# Altium project Transceiver_Project.PrjPCB
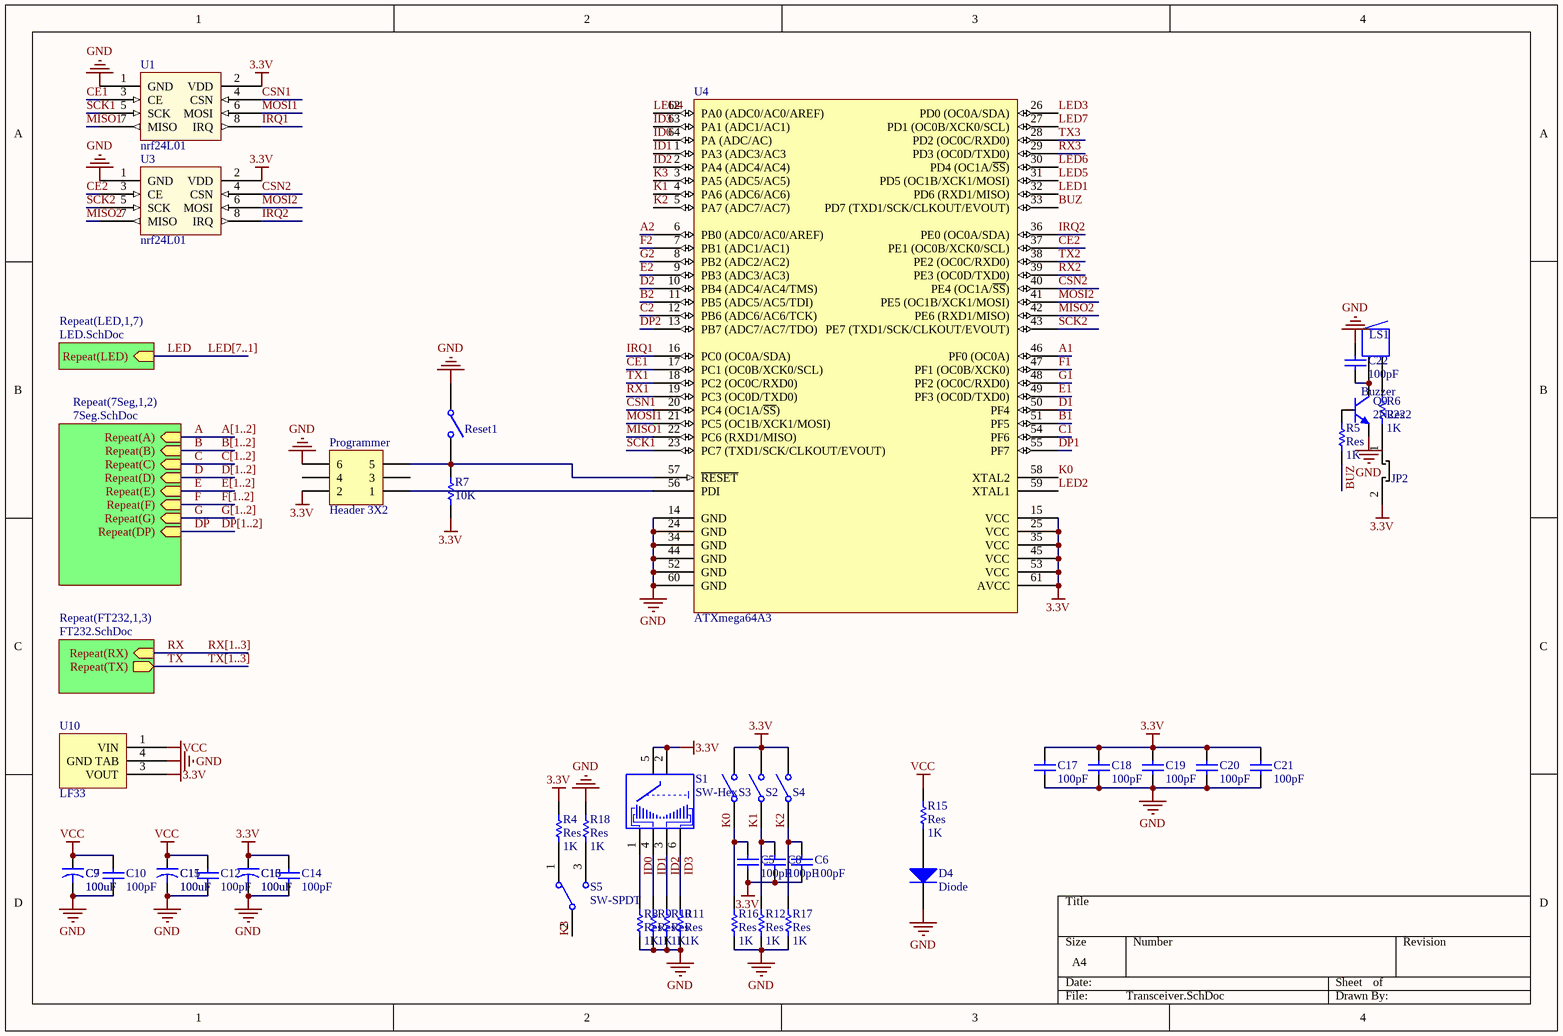
[diagram p0: Transceiver.SchDoc]
4 sheets, 117 parts. Net scope: hierarchical (ports join the sheet entries above them; power ports are global).
Board file: Transceiver.PcbDoc
Sheets:
  Transceiver.SchDoc
    FT2321 = FT232.SchDoc
    FT2322 = FT232.SchDoc
    FT2323 = FT232.SchDoc
    7Seg1 = 7Seg.SchDoc
    7Seg2 = 7Seg.SchDoc
    LED1 = LED.SchDoc
    LED2 = LED.SchDoc
    LED3 = LED.SchDoc
    LED4 = LED.SchDoc
    LED5 = LED.SchDoc
    LED6 = LED.SchDoc
    LED7 = LED.SchDoc

## Sheet Transceiver.SchDoc
size A4

### Parts
C5  value 100pF  [2012[0805]]  (hidden comment: Cap_UP)
C6  value 100pF  [2012[0805]]  (hidden comment: Cap_UP)
C7  value 100uF  [EL_M]  (hidden comment: Cap_El)
C8  value 100pF  [2012[0805]]  (hidden comment: Cap_UP)
C9  value 100uF  [EL_M]  (hidden comment: Cap_El)
C10  value 100pF  [2012[0805]]  (hidden comment: Cap_UP)
C11  value 100uF  [EL_M]  (hidden comment: Cap_El)
C12  value 100pF  [2012[0805]]  (hidden comment: Cap_UP)
C13  value 100uF  [EL_M]  (hidden comment: Cap_El)
C14  value 100pF  [2012[0805]]  (hidden comment: Cap_UP)
C15  value 100uF  [EL_M]  (hidden comment: Cap_El)
C16  value 100uF  [EL_M]  (hidden comment: Cap_El)
C17  value 100pF  [2012[0805]]  (hidden comment: Cap_UP)
C18  value 100pF  [2012[0805]]  (hidden comment: Cap_UP)
C19  value 100pF  [2012[0805]]  (hidden comment: Cap_UP)
C20  value 100pF  [2012[0805]]  (hidden comment: Cap_UP)
C21  value 100pF  [2012[0805]]  (hidden comment: Cap_UP)
C22  value 100pF  [2012[0805]]  (hidden comment: Cap_UP)
D4  Diode  [2012[0805]]
JP2  JUMPER  [HDR1X2]  (value not drawn)
LS1  Buzzer  [BUZZER]
Programmer  Header 3X2  [HDRBOX2X3]
Q9  2N2222  [SOT-23]
R4  Res  value 1K  [2012[0805]]
R5  Res  value 1K  [2012[0805]]
R6  Res  value 1K  [2012[0805]]
R7  10K  [2012[0805]]
R8  Res  value 1K  [2012[0805]]
R9  Res  value 1K  [2012[0805]]
R10  Res  value 1K  [2012[0805]]
R11  Res  value 1K  [2012[0805]]
R12  Res  value 1K  [2012[0805]]
R15  Res  value 1K  [2012[0805]]
R16  Res  value 1K  [2012[0805]]
R17  Res  value 1K  [2012[0805]]
R18  Res  value 1K  [2012[0805]]
Reset1  SW-SPST  [PUSH-BUT]  (value not drawn)
S1  SW-Hex  [SW-HEX]
S2  SW-SPST  [PUSH-BUT-SMD]  (value not drawn)
S3  SW-SPST  [PUSH-BUT]  (value not drawn)
S4  SW-SPST  [PUSH-BUT]  (value not drawn)
S5  SW-SPDT  [SW-SPDT]
U1  nrf24L01  [NRF24L01+PA+LNA]
U3  nrf24L01  [NRF24L01+PA+LNA]
U4  ATXmega64A3  [64A_N]
U10  LF33  [D-PACK]

### Sub-sheets
Repeat(7Seg,1,2) = 7Seg.SchDoc: Repeat(A) (in), Repeat(B) (in), Repeat(C) (in), Repeat(D) (in), Repeat(E) (in), Repeat(F) (in), Repeat(G) (in), Repeat(DP) (in)
Repeat(FT232,1,3) = FT232.SchDoc: Repeat(RX) (in), Repeat(TX) (out)
Repeat(LED,1,7) = LED.SchDoc: Repeat(LED) (in)

### Nets
3.3V: C5.2 C6.2 C8.2 C13.1 C14.2 C16.1 C17.2 C18.2 C19.2 C20.2 C21.2 JP2.2 Programmer.2 R4.2 R7.1 S1.2 S1.5 S2.2(NO) S3.2(NO) S4.2(NO) U1.2(VDD) U3.2(VDD) U4.15(VCC) U4.25(VCC) U4.35(VCC) U4.45(VCC) U4.53(VCC) U4.61(AVCC) U10.3(VOUT)
GND: C7.2 C9.2 C10.1 C11.2 C12.1 C13.2 C14.1 C15.2 C16.2 C17.1 C18.1 C19.1 C20.1 C21.1 C22.2 D4.2(K) Programmer.6 Q9.3(E) R8.1 R9.1 R10.1 R11.1 R12.1 R16.1 R17.1 R18.2 Reset1.1(COMMON) U1.1(GND) U3.1(GND) U4.14(GND) U4.24(GND) U4.34(GND) U4.44(GND) U4.52(GND) U4.60(GND) U10.4(GND_TAB)
VCC: C7.1 C9.1 C10.2 C11.1 C12.2 C15.1 R15.1 U10.1(VIN)
A: sheet Repeat(7Seg,1,2)/Repeat(A)
A1: U4.46(PF0_(OC0A))  [project net A]
A2: U4.6(PB0_(ADC0/AC0/AREF))  [project net A]
B: sheet Repeat(7Seg,1,2)/Repeat(B)
B1: U4.51(PF5)  [project net B]
B2: U4.11(PB5_(ADC5/AC5/TDI))  [project net B]
BUZ: R5.2 U4.33(PD7_(TXD1/SCK/CLKOUT/EVOUT))
C: sheet Repeat(7Seg,1,2)/Repeat(C)
C1: U4.54(PF6)  [project net C]
C2: U4.12(PB6_(ADC6/AC6/TCK))  [project net C]
CE1: U1.3(CE) U4.17(PC1_(OC0B/XCK0/SCL))
CE2: U3.3(CE) U4.37(PE1_(OC0B/XCK0/SCL))
CSN1: U1.4(CSN) U4.20(PC4_(OC1A/~{SS}))
CSN2: U3.4(CSN) U4.40(PE4_(OC1A/~{SS}))
D: sheet Repeat(7Seg,1,2)/Repeat(D)
D1: U4.50(PF4)  [project net D]
D2: U4.10(PB4_(ADC4/AC4/TMS))  [project net D]
DP: sheet Repeat(7Seg,1,2)/Repeat(DP)
DP1: U4.55(PF7)  [project net DP]
DP2: U4.13(PB7_(ADC7/AC7/TDO))  [project net DP]
E: sheet Repeat(7Seg,1,2)/Repeat(E)
E1: U4.49(PF3_(OC0D/TXD0))  [project net E]
E2: U4.9(PB3_(ADC3/AC3))  [project net E]
F: sheet Repeat(7Seg,1,2)/Repeat(F)
F1: U4.47(PF1_(OC0B/XCK0))  [project net F]
F2: U4.7(PB1_(ADC1/AC1))  [project net F]
G: sheet Repeat(7Seg,1,2)/Repeat(G)
G1: U4.48(PF2_(OC0C/RXD0))  [project net G]
G2: U4.8(PB2_(ADC2/AC2))  [project net G]
ID0: R8.2 S1.1 U4.64(PA_(ADC/AC))
ID1: R9.2 S1.4 U4.1(PA3_(ADC3/AC3)
ID2: R10.2 S1.3 U4.2(PA4_(ADC4/AC4))
ID3: R11.2 S1.6 U4.63(PA1_(ADC1/AC1))
IRQ1: U1.8(IRQ) U4.16(PC0_(OC0A/SDA))
IRQ2: U3.8(IRQ) U4.36(PE0_(OC0A/SDA))
K0: C5.1 R16.2 S3.1(COMMON) U4.58(XTAL2)
K1: C8.1 R12.2 S2.1(COMMON) U4.4(PA6_(ADC6/AC6))
K2: C6.1 R17.2 S4.1(COMMON) U4.5(PA7_(ADC7/AC7))
K3: S5.2 U4.3(PA5_(ADC5/AC5))
LED: sheet Repeat(LED,1,7)/Repeat(LED)
LED1: U4.32(PD6_(RXD1/MISO))
LED2: U4.59(XTAL1)
LED3: U4.26(PD0_(OC0A/SDA))
LED4: U4.62(PA0_(ADC0/AC0/AREF))
LED5: U4.31(PD5_(OC1B/XCK1/MOSI))
LED6: U4.30(PD4_(OC1A/~{SS}))
LED7: U4.27(PD1_(OC0B/XCK0/SCL))
MISO1: U1.7(MISO) U4.22(PC6_(RXD1/MISO))
MISO2: U3.7(MISO) U4.42(PE6_(RXD1/MISO))
MOSI1: U1.6(MOSI) U4.21(PC5_(OC1B/XCK1/MOSI))
MOSI2: U3.6(MOSI) U4.41(PE5_(OC1B/XCK1/MOSI))
RX: sheet Repeat(FT232,1,3)/Repeat(RX)
RX1: U4.19(PC3_(OC0D/TXD0))
RX2: U4.39(PE3_(OC0D/TXD0))
RX3: U4.29(PD3_(OC0D/TXD0))
SCK1: U1.5(SCK) U4.23(PC7_(TXD1/SCK/CLKOUT/EVOUT))
SCK2: U3.5(SCK) U4.43(PE7_(TXD1/SCK/CLKOUT/EVOUT))
TX: sheet Repeat(FT232,1,3)/Repeat(TX)
TX1: U4.18(PC2_(OC0C/RXD0))
TX2: U4.38(PE2_(OC0C/RXD0))
TX3: U4.28(PD2_(OC0C/RXD0))
NetC22_1: C22.1 LS1.1 Q9.1(C)
NetD4_1: D4.1(A) R15.2
NetJP2_1: JP2.1 R6.2
NetLS1_2: LS1.2 R6.1
NetProgrammer_1: Programmer.1 U4.56(PDI)
NetProgrammer_5: Programmer.5 R7.2 Reset1.2(NO) U4.57(~{RESET})
NetQ9_2: Q9.2(B) R5.1
NetR4_1: R4.1 S5.1
NetR18_1: R18.1 S5.3

Not connected (* = marked no-connect by the designer): Programmer 3 4

### Buses and harness runs
bus A[1..2]
bus B[1..2]
bus C[1..2]
bus D[1..2]
bus DP[1..2]
bus E[1..2]
bus F[1..2]
bus G[1..2]
bus LED[7..1]
bus RX[1..3]
bus TX[1..3]

### Library data of the parts
C5 C6 C8 C10 C12 C14 C17-C22 = Cap_UP: Capacitor; Published: 8-Jun-2000; LatestRevisionDate: 17-Jul-2002; LatestRevisionNote: Re-released for DXP Platform.; PackageReference: RAD-0.3; Publisher: Altium Limited
C7 C9 C11 C13 C15 C16 = Cap_El: Capacitor; Published: 23-Sep-2002; PackageReference: CAPR5-4X5; Publisher: Altium Limited
D4 = Diode: 1 Amp General Purpose Rectifier; Revision 1: 11-Jul-2000: SIM Model Added.; Revision 2: 17-Jul-2002: Re-released for DXP Platform.; Package Information: Latest Revision: Aug-1999; Code - JEDEC: DO-204-AL; Published: 8-Jun-2000; Datasheet: Latest Revision: 1998; Package Reference: DO-41; Publisher: Altium Limited
LS1 = Buzzer: Magnetic Transducer Buzzer; Published: 24-Mar-1999; LatestRevisionDate: 17-Dec-2003; LatestRevisionNote: Schematic revised, PCB Footprint replaced.; DatasheetDocument: 17-Dec-2003; PackageReference: ABSM-1574; Publisher: Altium Limited; ComponentLink1Description: Manufacturer Link; ComponentLink1URL: http://www.megastar.com/linecard/buzzmode/index.php
Programmer = Header 3X2: Header, 3-Pin, Dual row; LatestRevisionDate: 17-Jul-2002; LatestRevisionNote: Re-released for DXP Platform.; Publisher: Altium Limited
Q9 = 2N2222: NPN Bipolar Transistor; Published: 8-Jun-2000; LatestRevisionDate: 17-Jul-2002; LatestRevisionNote: Re-released for DXP Platform.; PackageReference: TO-226; Publisher: Altium Limited; Code_JEDEC: TO-226-AA
R4-R12 R15-R18 = Res: Semiconductor Resistor; Published: 8-Jun-2000; LatestRevisionDate: 17-Jul-2002; LatestRevisionNote: Re-released for DXP Platform.; PackageReference: AXIAL-0.5; Publisher: Altium Limited
Reset1 S2-S4 = SW-SPST: Single-Pole, Single-Throw Switch; Published: 24-Mar-1999; Revision: July-2002: Re-released for DXP Platform.; Publisher: Altium Limited
S5 = SW-SPDT: SPDT Subminiature Toggle Switch, Right Angle Mounting, Vertical Actuation; Published: 24-Mar-1999; LatestRevisionDate: 17-Dec-2003; LatestRevisionNote: Schematic revised, PCB Footprint replaced.; DatasheetDocument: 05-Dec-2000; PackageReference: TL36WW15050; Publisher: Altium Limited; ComponentLink1Description: Manufacturer Link; ComponentLink1URL: http://www.apem.com
U10 = 7805
S1 = SW-Hex: Published: 24-Mar-1999; LatestRevisionDate: 17-Jul-2002; LatestRevisionNote: Re-released for DXP Platform.; PackageReference: DIP-8; Publisher: Altium Limited

## Sheet FT232.SchDoc
size A4
Used 3 times, as channels FT2321, FT2322, FT2323. Parts and nets are listed once, with the designators drawn on the sheet.
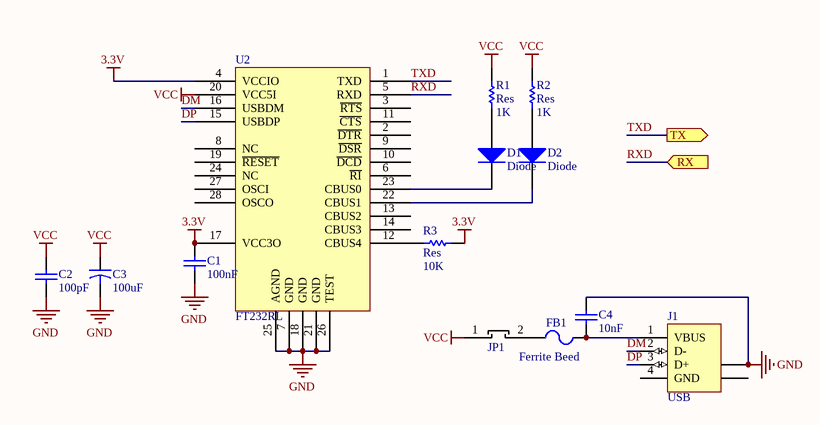
[diagram p1: FT232.SchDoc]

### Parts
C1  value 100nF  [2012[0805]]  (hidden comment: Cap_UP)
C2  value 100pF  [2012[0805]]  (hidden comment: Cap_UP)
C3  value 100uF  [2012[0805]]  (hidden comment: Cap_El)
C4  value 10nF  [2012[0805]]  (hidden comment: Cap_UP)
D1  Diode  [2012[0805]]
D2  Diode  [2012[0805]]
FB1  Ferrite Beed  [2012[0805]]
J1  USB  [USB_Mini]
JP1  JUMPER  [HDR1X2]  (value not drawn)
R1  Res  value 1K  [2012[0805]]
R2  Res  value 1K  [2012[0805]]
R3  Res  value 10K  [2012[0805]]
U2  FT232RL  [SSOP28]

### Ports
RX (in), TX (out)

### Nets
3.3V: C1.2 R3.2 U2.4(VCCIO) U2.17(VCC3O)
GND: C1.1 C2.1 C3.2 C4.1 J1.5(SHLD) U2.7(GND) U2.18(GND) U2.21(GND) U2.25(AGND) U2.26(TEST)
VCC: C2.2 C3.1 JP1.1 R1.2 R2.2 U2.20(VCC5I)
DM: J1.2(D-) U2.16(USBDM)
DP: J1.3(D+) U2.15(USBDP)
RXD: U2.5(RXD) ; port RX
TXD: U2.1(TXD) ; port TX
NetC4_2: C4.2 FB1.2 J1.1(VBUS)
NetD1_1: D1.1(A) R1.1
NetD1_2: D1.2(K) U2.23(CBUS0)
NetD2_1: D2.1(A) R2.1
NetD2_2: D2.2(K) U2.22(CBUS1)
NetFB1_1: FB1.1 JP1.2
NetR3_1: R3.1 U2.12(CBUS4)

Not connected (* = marked no-connect by the designer): J1 4(GND) 6(SHLD); U2 2(~{DTR}) 3(~{RTS}) 6(~{RI}) 8(NC) 9(~{DSR}) 10(~{DCD}) 11(~{CTS}) 13(CBUS2) 14(CBUS3) 19(~{RESET}) 24(NC) 27(OSCI) 28(OSCO)

### Channels
FT2321: designators end in _FT2321; ports RX=RX1 TX=TX1
FT2322: designators end in _FT2322; ports RX=RX2 TX=TX2
FT2323: designators end in _FT2323; ports RX=RX3 TX=TX3

### Library data of the parts
C1 C2 C4 = Cap_UP: Capacitor; Published: 8-Jun-2000; LatestRevisionDate: 17-Jul-2002; LatestRevisionNote: Re-released for DXP Platform.; PackageReference: RAD-0.3; Publisher: Altium Limited
C3 = Cap_El: Capacitor; Published: 23-Sep-2002; PackageReference: CAPR5-4X5; Publisher: Altium Limited
D1 D2 = Diode: as D4 on sheet Transceiver; Published: 8-Jun-2000; Datasheet: Latest Revision: 1998; Package Reference: DO-41; Publisher: Altium Limited
FB1 = Ferrite Beed: Code_IEC: 1005; Published: 8-Jun-2000; LatestRevisionDate: 17-Jul-2002; LatestRevisionNote: Re-released for DXP Platform.; PackageReference: 0402-A; Publisher: Altium Limited; Code_JEITA: 0402
J1 = USB: USB 1.1, Right Angle, Thru-Hole, A Type, Receptacle, 4 Position, Black; ContactMaterial: Copper Alloy; ContactPlating: Gold (30) over Palladium Nickel; TerminationLength: 2.84mm [0.112in.]; PCB_Layout: Complies with manufacturer's recommendation.; DrillSize: Corresponds to nominal value.; PanelGround: Without; Published: 15-Jul-2004; DatasheetDocument: 11-Jan-2004; PackageDocument: 11-Jan-2004; PackageReference: 1364372; Publisher: Altium Limited; HousingMaterial: Thermoplastic; ComponentLink1Description: Manufacturer Link; ComponentLink1URL: http://www.tycoelectronics.com/; ComponentLink2Description: Packaging Specification; ComponentLink2URL: http://ecommas.tycoelectronics.com/commerce/DocumentDelivery/DDEController?Action=showdoc&DocId=Customer+Drawing%7F1364372%7FD%7Ftif%7FEnglish%7FENG_CD_1364372_D.tif
R1-R3 = Res: Semiconductor Resistor; Published: 8-Jun-2000; LatestRevisionDate: 17-Jul-2002; LatestRevisionNote: Re-released for DXP Platform.; PackageReference: AXIAL-0.5; Publisher: Altium Limited

## Sheet 7Seg.SchDoc
size A4
Used 2 times, as channels 7Seg1, 7Seg2. Parts and nets are listed once, with the designators drawn on the sheet.
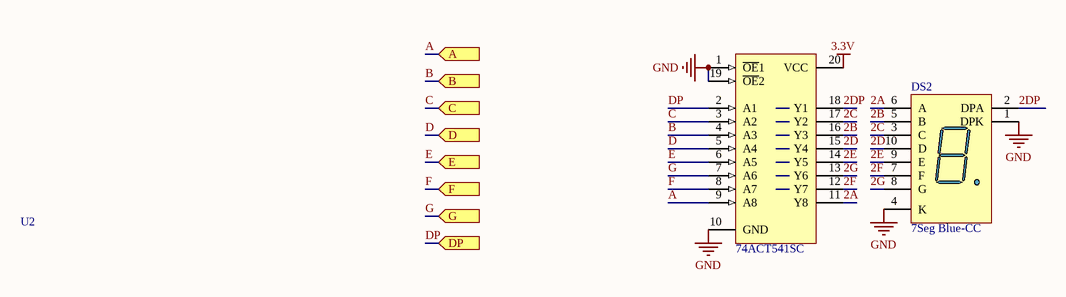
[diagram p2: 7Seg.SchDoc]

### Parts
DS2  7Seg Blue-CC  [7Segment Small]
U2  74ACT541SC  [M20B_M]

### Ports
A (in), B (in), C (in), D (in), DP (in), E (in), F (in), G (in)

### Nets
3.3V: U2.20(VCC)
GND: DS2.1(DPK) DS2.4(K) U2.1(~{OE}1) U2.10(GND) U2.19(~{OE}2)
2A: DS2.6(A) U2.11(Y8)
2B: DS2.5(B) U2.16(Y3)
2C: DS2.3(C) U2.17(Y2)
2D: DS2.10(D) U2.15(Y4)
2DP: DS2.2(DPA) U2.18(Y1)
2E: DS2.9(E) U2.14(Y5)
2F: DS2.7(F) U2.12(Y7)
2G: DS2.8(G) U2.13(Y6)
A: U2.9(A8) ; port A
B: U2.4(A3) ; port B
C: U2.3(A2) ; port C
D: U2.5(A4) ; port D
DP: U2.2(A1) ; port DP
E: U2.6(A5) ; port E
F: U2.8(A7) ; port F
G: U2.7(A6) ; port G

### Channels
7Seg1: designators end in _7Seg1; ports A=A B=B C=C D=D DP=DP E=E F=F G=G
7Seg2: designators end in _7Seg2; ports A=A B=B C=C D=D DP=DP E=E F=F G=G

### Library data of the parts
DS2 = 7Seg Blue-CC_1: 14.2 mm General Purpose Blue 7-Segment Display: CC, RH DP, Gray Surface; MinimumIntensity: 2020 ucd; Note: IF = 10 mA; Published: 8-Jun-2000; LatestRevisionDate: 17-Dec-2003; LatestRevisionNote: Schematic revised, PCB Footprint replaced.; DatasheetDocument: 24-Sep-2002; PackageDocument: 24-Sep-2002; PackageReference: H; Publisher: Altium Limited; Colour: Blue; ComponentLink1Description: Manufacturer Link; ComponentLink1URL: http://www.agilent.com/
U2 = 74ACT541SC: Octal Buffer/Line Driver with 3-State Output; Published: 17-Jul-2002; LatestRevisionDate: 13-Apr-2006; LatestRevisionNote: IPC-7351 Footprint Added.; DatasheetVersion: Oct-1999; PackageVersion: 2000; PackageReference: M20B; Publisher: Altium Limited; PackageDescription: 20-Pin Small Outline Integrated Circuit 1.27 mm Pitch; Code_JEDEC: MS-013-AC; Code_IPC: SOIC127P1030-20; ComponentLink1Description: Manufacturer Link; ComponentLink1URL: http://www.fairchildsemi.com/; ComponentLink2Description: Datasheet; ComponentLink2URL: http://www.fairchildsemi.com/ds/74%2F74AC541.pdf

## Sheet LED.SchDoc
size A
Used 7 times, as channels LED1, LED2, LED3, LED4, LED5, LED6, LED7. Parts and nets are listed once, with the designators drawn on the sheet.
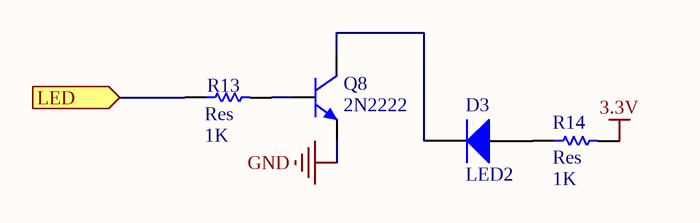
[diagram p3: LED.SchDoc]

### Parts
D3  LED2  [2012[0805]]
Q8  2N2222  [SOT-23]
R13  Res  value 1K  [2012[0805]]
R14  Res  value 1K  [2012[0805]]

### Ports
LED (in)

### Nets
3.3V: R14.2
GND: Q8.3(E)
LED: R13.1 ; port LED
NetD3_1: D3.1(A) R14.1
NetD3_2: D3.2(K) Q8.1(C)
NetQ8_2: Q8.2(B) R13.2

### Channels
LED1: designators end in _LED1; ports LED=LED1
LED2: designators end in _LED2; ports LED=LED2
LED3: designators end in _LED3; ports LED=LED3
LED4: designators end in _LED4; ports LED=LED4
LED5: designators end in _LED5; ports LED=LED5
LED6: designators end in _LED6; ports LED=LED6
LED7: designators end in _LED7; ports LED=LED7

### Library data of the parts
D3 = Diode: as D4 on sheet Transceiver; Published: 8-Jun-2000; Datasheet: Latest Revision: 1998; Package Reference: DO-41; Publisher: Altium Limited
Q8 = 2N2222: NPN Bipolar Transistor; Published: 8-Jun-2000; LatestRevisionDate: 17-Jul-2002; LatestRevisionNote: Re-released for DXP Platform.; PackageReference: TO-226; Publisher: Altium Limited; Code_JEDEC: TO-226-AA
R13 R14 = Res: Semiconductor Resistor; Published: 8-Jun-2000; LatestRevisionDate: 17-Jul-2002; LatestRevisionNote: Re-released for DXP Platform.; PackageReference: AXIAL-0.5; Publisher: Altium Limited

## Nets that join several sheets
3.3V: Transceiver (29 pins), FT2321 (C1_FT2321.2 R3_FT2321.2 U2_FT2321.4 U2_FT2321.17), FT2322 (C1_FT2322.2 R3_FT2322.2 U2_FT2322.4 U2_FT2322.17), FT2323 (C1_FT2323.2 R3_FT2323.2 U2_FT2323.4 U2_FT2323.17), 7Seg1 (U2_7Seg1.20), 7Seg2 (U2_7Seg2.20), LED1 (R14_LED1.2), LED2 (R14_LED2.2), LED3 (R14_LED3.2), LED4 (R14_LED4.2), LED5 (R14_LED5.2), LED6 (R14_LED6.2), LED7 (R14_LED7.2)
GND: Transceiver (36 pins), FT2321 (10 pins), FT2322 (10 pins), FT2323 (10 pins), 7Seg1 (5 pins), 7Seg2 (5 pins), LED1 (Q8_LED1.3), LED2 (Q8_LED2.3), LED3 (Q8_LED3.3), LED4 (Q8_LED4.3), LED5 (Q8_LED5.3), LED6 (Q8_LED6.3), LED7 (Q8_LED7.3)
VCC: Transceiver (8 pins), FT2321 (6 pins), FT2322 (6 pins), FT2323 (6 pins)
A: Transceiver (U4.6), 7Seg2 (U2_7Seg2.9)
A: Transceiver (U4.46), 7Seg1 (U2_7Seg1.9)
B: Transceiver (U4.11), 7Seg2 (U2_7Seg2.4)
B: Transceiver (U4.51), 7Seg1 (U2_7Seg1.4)
C: Transceiver (U4.12), 7Seg2 (U2_7Seg2.3)
C: Transceiver (U4.54), 7Seg1 (U2_7Seg1.3)
D: Transceiver (U4.10), 7Seg2 (U2_7Seg2.5)
D: Transceiver (U4.50), 7Seg1 (U2_7Seg1.5)
DP: Transceiver (U4.13), 7Seg2 (U2_7Seg2.2)
DP: Transceiver (U4.55), 7Seg1 (U2_7Seg1.2)
E: Transceiver (U4.9), 7Seg2 (U2_7Seg2.6)
E: Transceiver (U4.49), 7Seg1 (U2_7Seg1.6)
F: Transceiver (U4.7), 7Seg2 (U2_7Seg2.8)
F: Transceiver (U4.47), 7Seg1 (U2_7Seg1.8)
G: Transceiver (U4.8), 7Seg2 (U2_7Seg2.7)
G: Transceiver (U4.48), 7Seg1 (U2_7Seg1.7)
LED1: Transceiver (U4.32), LED1 (R13_LED1.1)
LED2: Transceiver (U4.59), LED2 (R13_LED2.1)
LED3: Transceiver (U4.26), LED3 (R13_LED3.1)
LED4: Transceiver (U4.62), LED4 (R13_LED4.1)
LED5: Transceiver (U4.31), LED5 (R13_LED5.1)
LED6: Transceiver (U4.30), LED6 (R13_LED6.1)
LED7: Transceiver (U4.27), LED7 (R13_LED7.1)
RX1: Transceiver (U4.19), FT2321 (U2_FT2321.5)
RX2: Transceiver (U4.39), FT2322 (U2_FT2322.5)
RX3: Transceiver (U4.29), FT2323 (U2_FT2323.5)
TX1: Transceiver (U4.18), FT2321 (U2_FT2321.1)
TX2: Transceiver (U4.38), FT2322 (U2_FT2322.1)
TX3: Transceiver (U4.28), FT2323 (U2_FT2323.1)